# Altium schematic sheet UI.SchDoc
size A4; SheetNumber: 1; SheetTotal: 1
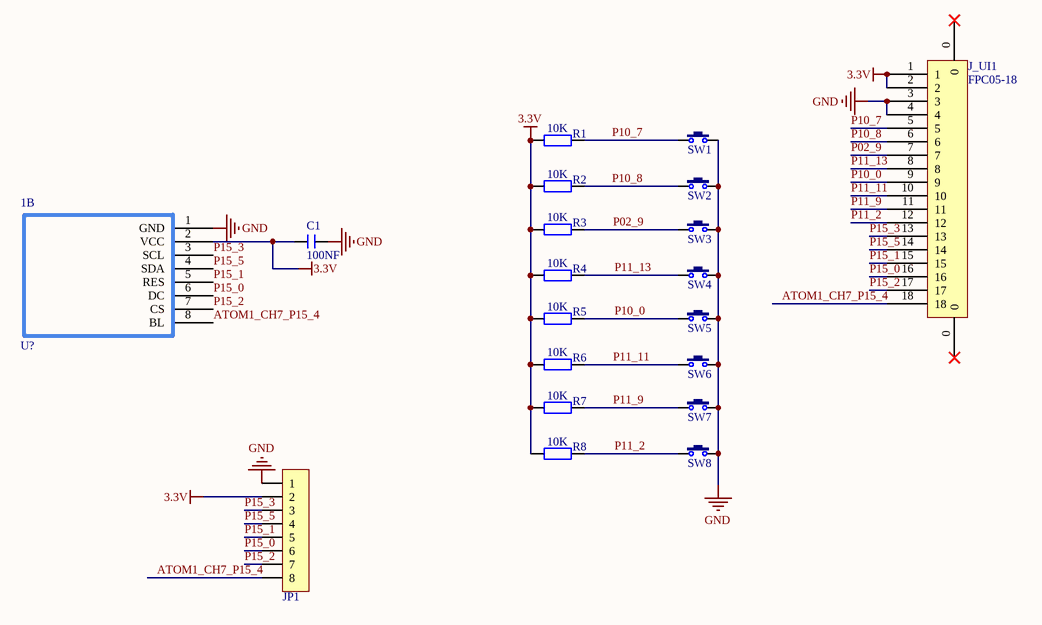
[diagram p0: UI.SchDoc]

## Parts
1  U?  [1.8'TFT]  (part B of 2)
C1  100NF  [C 0805_L]
J_UI1  FPC05-18  [FPC-05mm-18]
JP1  HDR-1X8  [HDR2.54-LI-8P]  (value not drawn)
R1  10K  [R 0805_L]
R2  10K  [R 0805_L]
R3  10K  [R 0805_L]
R4  10K  [R 0805_L]
R5  10K  [R 0805_L]
R6  10K  [R 0805_L]
R7  10K  [R 0805_L]
R8  10K  [R 0805_L]
SW1  3x6x5  [TSW SMD-3*6*2.5]  (value not drawn)
SW2  3x6x5  [TSW SMD-3*6*2.5]  (value not drawn)
SW3  3x6x5  [TSW SMD-3*6*2.5]  (value not drawn)
SW4  3x6x5  [TSW SMD-3*6*2.5]  (value not drawn)
SW5  3x6x5  [TSW SMD-3*6*2.5]  (value not drawn)
SW6  3x6x5  [TSW SMD-3*6*2.5]  (value not drawn)
SW7  3x6x5  [TSW SMD-3*6*2.5]  (value not drawn)
SW8  3x6x5  [TSW SMD-3*6*2.5]  (value not drawn)

## Nets
3.3V: 1.2(VCC) C1.2 J_UI1.1 J_UI1.2 JP1.2 R1.1 R2.1 R3.1 R4.1 R5.1 R6.1 R7.1 R8.1
GND: 1.1(GND) C1.1 J_UI1.3 J_UI1.4 JP1.1 SW1.2 SW2.2 SW3.2 SW4.2 SW5.2 SW6.2 SW7.2 SW8.2
ATOM1_CH7_P15_4: 1.8(BL) J_UI1.18 JP1.8
P02_9: J_UI1.7 R3.2 SW3.1
P10_0: J_UI1.9 R5.2 SW5.1
P10_7: J_UI1.5 R1.2 SW1.1
P10_8: J_UI1.6 R2.2 SW2.1
P11_2: J_UI1.12 R8.2 SW8.1
P11_9: J_UI1.11 R7.2 SW7.1
P11_11: J_UI1.10 R6.2 SW6.1
P11_13: J_UI1.8 R4.2 SW4.1
P15_0: 1.6(DC) J_UI1.16 JP1.6
P15_1: 1.5(RES) J_UI1.15 JP1.5
P15_2: 1.7(CS) J_UI1.17 JP1.7
P15_3: 1.3(SCL) J_UI1.13 JP1.3
P15_5: 1.4(SDA) J_UI1.14 JP1.4

Not connected (* = marked no-connect by the designer): J_UI1 0*

## Library data of the parts
1 = 1.8'TFT
C1 = C: 无极性贴片电容; 版权归属: 源创客; 材质: X7R; BOM名称: 无极性贴片电容; 学习资源: www.ooocke.com
JP1 = Header 8: 8P接插件; 版权归属: 源创客; BOM名称: 8P接插件; 学习资源: www.ooocke.com
R1-R8 = R: 贴片电阻; 版权归属: 源创客; BOM名称: 贴片电阻; 学习资源: www.ooocke.com
SW1-SW8 = TSW 3x6: 3x6轻触开关; 版权归属: 源创客; BOM名称: 3x6轻触开关; 学习资源: www.ooocke.com